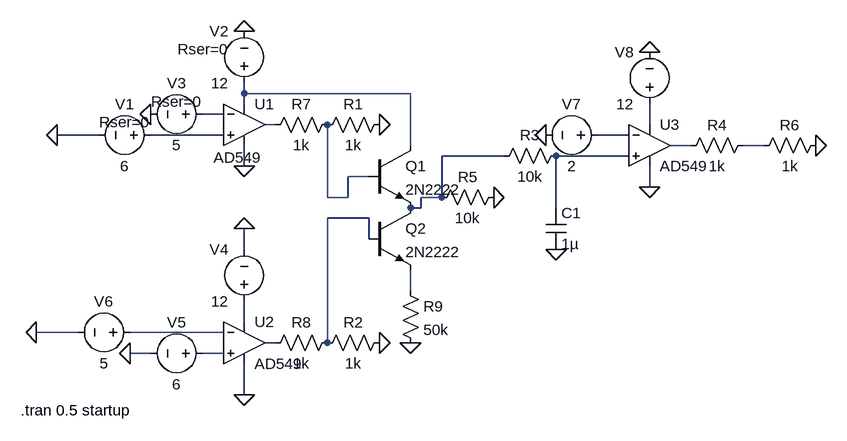
[diagram p0: schematic test3.asc]
test3.asc, the LTspice schematic file:
Version 4
SHEET 1 880 680
WIRE -64 -96 -64 -112
WIRE 192 -96 -64 -96
WIRE -64 -80 -64 -96
WIRE -96 -64 -128 -64
WIRE -16 -48 -32 -48
WIRE 560 -48 560 -80
WIRE -288 -32 -352 -32
WIRE -96 -32 -208 -32
WIRE 528 -32 480 -32
WIRE 192 -16 192 -96
WIRE 624 -16 592 -16
WIRE 736 -16 704 -16
WIRE 336 0 240 0
WIRE 528 0 416 0
WIRE -64 16 -64 -16
WIRE 128 32 96 32
WIRE 560 48 560 16
WIRE 64 64 64 -48
WIRE 96 64 96 32
WIRE 96 64 64 64
WIRE 240 64 240 0
WIRE 240 64 208 64
WIRE 208 80 208 64
WIRE 208 80 192 80
WIRE 416 80 416 0
WIRE 128 96 64 96
WIRE 128 128 128 96
WIRE -64 144 -64 112
WIRE 192 208 192 176
WIRE -64 256 -64 224
WIRE -320 272 -384 272
WIRE -96 272 -240 272
WIRE -16 288 -32 288
WIRE 64 288 64 96
WIRE -208 304 -240 304
WIRE -96 304 -128 304
WIRE -64 368 -64 320
FLAG -352 -32 0
FLAG -64 -192 0
FLAG -64 16 0
FLAG -208 -64 0
FLAG -64 368 0
FLAG -64 112 0
FLAG -240 304 0
FLAG -384 272 0
FLAG 320 64 0
FLAG 144 -48 0
FLAG 144 288 0
FLAG 400 -32 0
FLAG 560 48 0
FLAG 560 -160 0
FLAG 816 -16 0
FLAG 416 144 0
FLAG 192 288 0
SYMBOL OpAmps\\AD549 -64 -112 R0
WINDOW 3 -47 115 Left 2
SYMATTR InstName U1
SYMBOL voltage -192 -32 R90
WINDOW 0 -32 56 VBottom 2
WINDOW 3 32 56 VTop 2
WINDOW 123 0 0 Left 0
WINDOW 39 -4 56 VBottom 2
SYMATTR InstName V1
SYMATTR Value 6
SYMATTR SpiceLine Rser=0
SYMBOL res 160 -64 R90
WINDOW 0 0 56 VBottom 2
WINDOW 3 32 56 VTop 2
SYMATTR InstName R1
SYMATTR Value 1k
SYMBOL voltage -64 -96 R180
WINDOW 0 24 96 Left 2
WINDOW 3 24 16 Left 2
WINDOW 123 0 0 Left 0
WINDOW 39 24 68 Left 2
SYMATTR InstName V2
SYMATTR Value 12
SYMATTR SpiceLine Rser=0
SYMBOL voltage -112 -64 R90
WINDOW 0 -32 56 VBottom 2
WINDOW 3 32 56 VTop 2
WINDOW 123 0 0 Left 0
WINDOW 39 -4 56 VBottom 2
SYMATTR InstName V3
SYMATTR Value 5
SYMATTR SpiceLine Rser=0
SYMBOL OpAmps\\AD549 -64 224 R0
SYMATTR InstName U2
SYMBOL voltage -64 240 R180
WINDOW 0 24 96 Left 2
WINDOW 3 24 16 Left 2
WINDOW 123 0 0 Left 0
WINDOW 39 0 0 Left 0
SYMATTR InstName V4
SYMATTR Value 12
SYMBOL voltage -112 304 R90
WINDOW 0 -32 56 VBottom 2
WINDOW 3 32 56 VTop 2
WINDOW 123 0 0 Left 0
WINDOW 39 0 0 Left 0
SYMATTR InstName V5
SYMATTR Value 6
SYMBOL voltage -224 272 R90
WINDOW 0 -32 56 VBottom 2
WINDOW 3 32 56 VTop 2
WINDOW 123 0 0 Left 0
WINDOW 39 0 0 Left 0
SYMATTR InstName V6
SYMATTR Value 5
SYMBOL res 160 272 R90
WINDOW 0 0 56 VBottom 2
WINDOW 3 32 56 VTop 2
SYMATTR InstName R2
SYMATTR Value 1k
SYMBOL res 336 48 R90
WINDOW 0 0 56 VBottom 2
WINDOW 3 32 56 VTop 2
SYMATTR InstName R5
SYMATTR Value 10k
SYMBOL res 80 -64 R90
WINDOW 0 0 56 VBottom 2
WINDOW 3 32 56 VTop 2
SYMATTR InstName R7
SYMATTR Value 1k
SYMBOL res 80 272 R90
WINDOW 0 0 56 VBottom 2
WINDOW 3 32 56 VTop 2
SYMATTR InstName R8
SYMATTR Value 1k
SYMBOL res 432 -16 R90
WINDOW 0 0 56 VBottom 2
WINDOW 3 32 56 VTop 2
SYMATTR InstName R3
SYMATTR Value 10k
SYMBOL OpAmps\\AD549 560 -80 R0
SYMATTR InstName U3
SYMBOL voltage 496 -32 R90
WINDOW 0 -32 56 VBottom 2
WINDOW 3 32 56 VTop 2
WINDOW 123 0 0 Left 0
WINDOW 39 0 0 Left 0
SYMATTR InstName V7
SYMATTR Value 2
SYMBOL voltage 560 -64 R180
WINDOW 0 24 96 Left 2
WINDOW 3 24 16 Left 2
WINDOW 123 0 0 Left 0
WINDOW 39 0 0 Left 0
SYMATTR InstName V8
SYMATTR Value 12
SYMBOL res 720 -32 R90
WINDOW 0 0 56 VBottom 2
WINDOW 3 32 56 VTop 2
SYMATTR InstName R4
SYMATTR Value 1k
SYMBOL res 832 -32 R90
WINDOW 0 0 56 VBottom 2
WINDOW 3 32 56 VTop 2
SYMATTR InstName R6
SYMATTR Value 1k
SYMBOL cap 400 80 R0
SYMATTR InstName C1
SYMATTR Value 1µ
SYMBOL npn 128 -16 R0
SYMATTR InstName Q1
SYMATTR Value 2N2222
SYMBOL npn 128 80 R0
SYMATTR InstName Q2
SYMATTR Value 2N2222
SYMBOL res 176 192 R0
SYMATTR InstName R9
SYMATTR Value 50k
TEXT -408 392 Left 2 !.tran 0.5 startup

The netlist it stands for:
* test3.asc
XU1 N005 N002 N001 0 N003 AD549  ; pins In+ In- V+ V- OUT
V1 N005 0 6 Rser=0
R1 0 N011 1k
V2 N001 0 12 Rser=0
V3 N002 0 5 Rser=0
XU2 N017 N015 N014 0 N016 AD549  ; pins In+ In- V+ V- OUT
V4 N014 0 12
V5 N017 0 6
V6 N015 0 5
R2 0 N012 1k
R5 0 N009 10k
R7 N011 N003 1k
R8 N012 N016 1k
R3 N010 N009 10k
XU3 N010 N006 N004 0 N007 AD549  ; pins In+ In- V+ V- OUT
V7 N006 0 2
V8 N004 0 12
R4 N008 N007 1k
R6 0 N008 1k
C1 N010 0 1µ
Q1 N001 N011 N009 0 2N2222
Q2 N009 N012 N013 0 2N2222
R9 N013 0 50k
.model NPN NPN
.model PNP PNP
.lib standard.bjt
.tran 0.5 startup
.backanno
.end